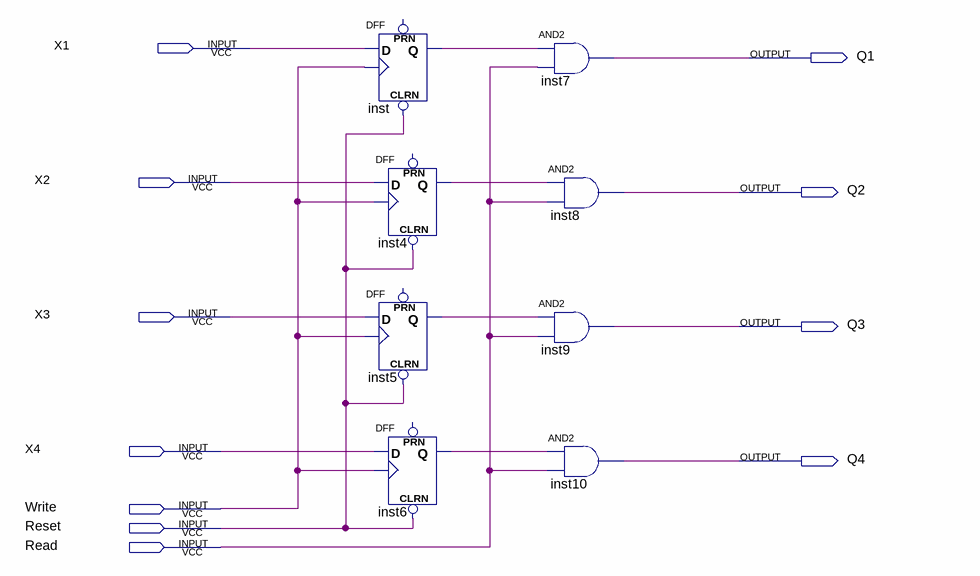
[diagram p0: schematic sheet]
// Quartus schematic Simplest_memory_regi.bdf as structural Verilog: 8 symbols, 11 pins
module Simplest_memory_regi (
  input  X1,
  input  X2,
  input  X3,
  input  X4,
  input  Write,
  input  Reset,
  input  Read,
  output Q1,
  output Q2,
  output Q3,
  output Q4
);

  wire inst4_q, inst5_q, inst6_q, inst_q;

  DFF inst (.CLRN(Reset), .CLK(Write), .D(X1), .Q(inst_q));  // open: PRN
  DFF inst5 (.CLRN(Reset), .CLK(Write), .D(X3), .Q(inst5_q));  // open: PRN
  DFF inst4 (.CLRN(Reset), .CLK(Write), .D(X2), .Q(inst4_q));  // open: PRN
  DFF inst6 (.CLRN(Reset), .CLK(Write), .D(X4), .Q(inst6_q));  // open: PRN
  and inst7 (Q1, inst_q, Read);
  and inst8 (Q2, inst4_q, Read);
  and inst9 (Q3, inst5_q, Read);
  and inst10 (Q4, inst6_q, Read);
endmodule
